# EAGLE design PLA_LED_Gen2_Rev4 (EAGLE 7.7.0)
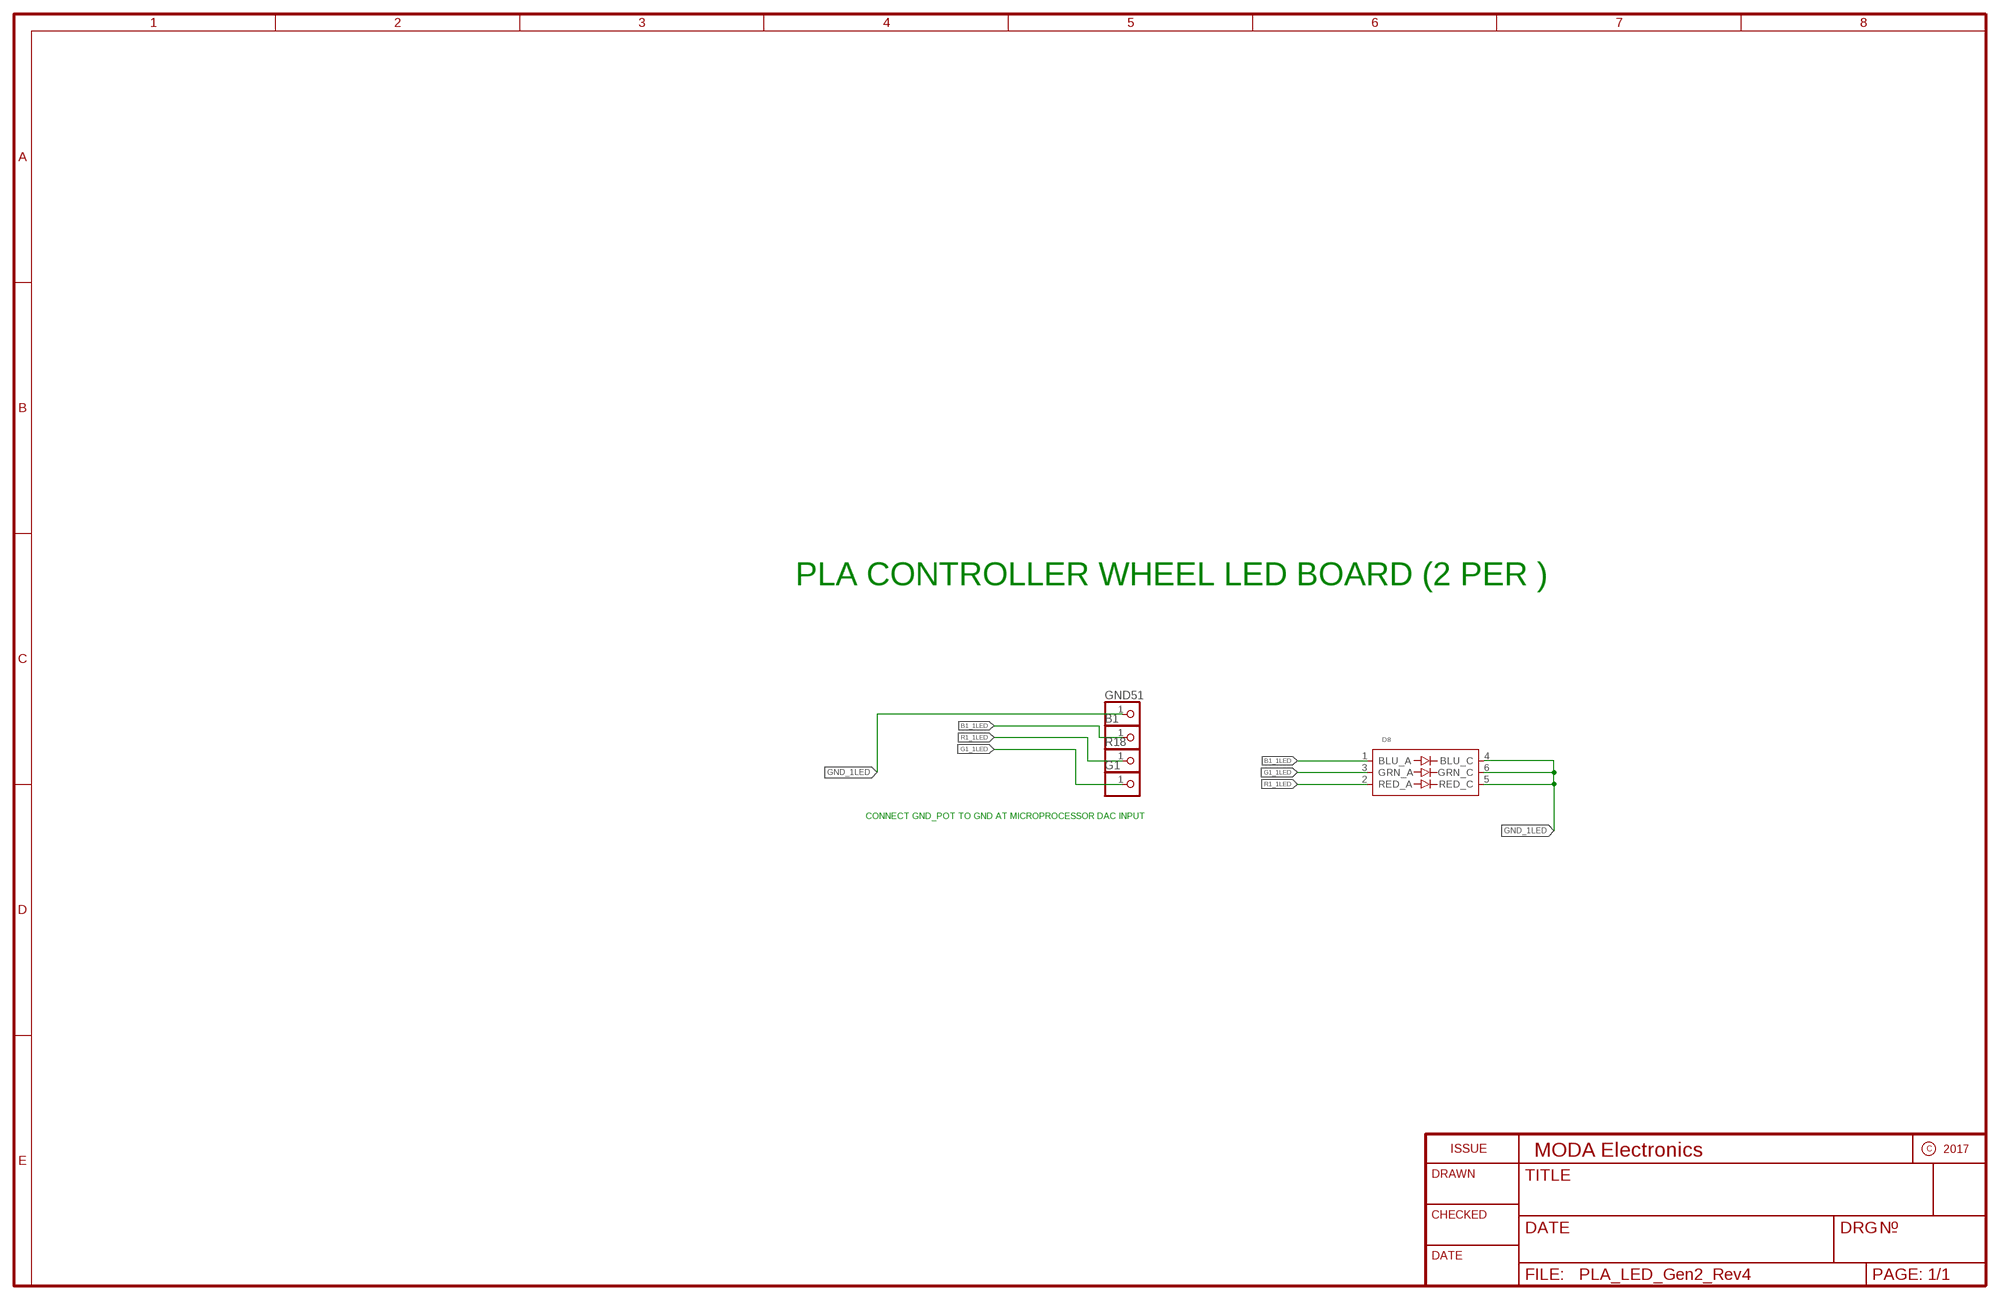
[diagram p0: schematic, sheet 1]

## Parts
B1  PINHD-1X1  [1X01]
D8  XZFBBM2ACRDG92W-3  [XZFBBM2ACRDG92W-3]
G1  PINHD-1X1  [1X01]
GND51  PINHD-1X1  [1X01]
R18  PINHD-1X1  [1X01]

## Nets
B1_1LED: B1.1 D8.1(BLU_A)
G1_1LED: D8.3(GRN_A) G1.1
GND_1LED [vcc]: D8.4(BLU_C) D8.5(RED_C) D8.6(GRN_C) GND51.1
R1_1LED: D8.2(RED_A) R18.1

## Notes on the sheet
- PLA CONTROLLER WHEEL LED BOARD (2 PER )
- CONNECT GND_POT TO GND AT MICROPROCESSOR DAC INPUT

## Library data of the parts
B1 G1 GND51 R18 = adafruit:PINHD-1X1: Pin header 1x1 for 0.1" spacing With round pins; DNP: T; PARTNO: *
D8 = XZFBBM2ACRDG92W-3:XZFBBM2ACRDG92W-3: Red, Green, Blue (RGB) 625nm Red, 525nm Green, 470nm Blue LED Indication - Discrete 2.2V Red, 3.2V Green, 3.3V Blue 6-SMD, No Lead ( https://www.digikey.com/product-detail/en/sunled/XZFBBM2ACRDG92W-3/1497-1226-1-ND/5001279 ); PARTNO: XZFBBM2ACRDG92W-3

## Net classes
0 default: width 0.203 mm, drill 0.305 mm, clearance 0.178 mm
1 vcc: width 0.203 mm, drill 0.305 mm, clearance 0.178 mm
3 diff90: width 0.406 mm, drill 0.356 mm, clearance 0.254 mm

## Board
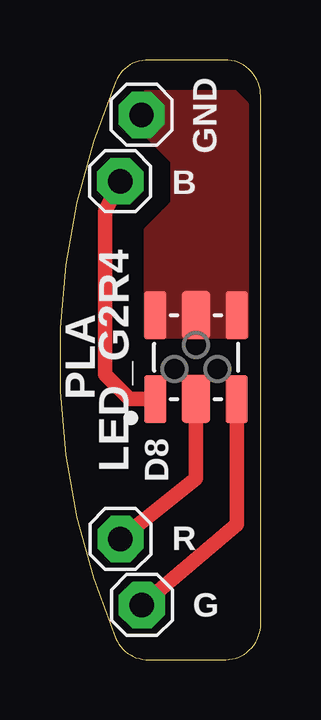
[diagram p1: board, top side]

Size 8.38 x 25 mm. Coordinates in mm from the lower left corner, seen from the top.
Outline: 6.92,0 arc90 8.38,1.51 8.38,23.51 arc90 6.88,25.01 3.71,25.01 arc68 2.32,24.1 arc46 2.32,0.9 arc68 3.72,0 6.92,0
Copper layers (1+2*15+16): Top 0.035mm / dielectric 0.3mm / GND 0.035mm / dielectric 0.85mm / Route15 0.035mm / dielectric 0.3mm / Bottom 0.035mm
Design rules "SSC-EAGLE-4Lyr_v1.0.0.3 *": minimum track width 7mil, minimum drill 12mil, track to track 7mil, track to pad 7mil, pad to pad 7mil, via to via 8mil, smd to smd 0mil, copper to edge 15mil, drill to drill 16mil, minimum pad ring 8mil, minimum via ring 8mil, stop-mask expansion 3mil, vias tented up to drill 14mil, thermal gap 10mil
tRestrict: area -99,-88.1 to -98.3,-88.1

### Footprints (pad centres in the part's own frame; a part is rotated, then mirrored left to right if it is on the bottom)
1X01 = drill 1.016 pad 1.93 octagon: 1 0,0
XZFBBM2ACRDG92W-3 = smd 2 x 0.9: 1 -1.75,1.7; 3 -1.75,-1.7; 4 1.75,1.7; 6 1.75,-1.7 | smd 2 x 1.2: 2 -1.75,0; 5 1.75,0

### Placement (x,y rotation side)
B1  2.52,19.95 0 top
D8  5.68,12.62 90 top
G1  3.42,2.28 0 top
GND51  3.41,22.72 0 top
R18  2.53,5.03 0 top
U$3  [FAB_FRAME_ANSI-A]  -116.72,-111.39 0 top  (outside the outline)
U$4  [FAB_DOCFIELD_GENERIC]  38.05,-111.16 0 top  (outside the outline)

### Tracks (layer width: path | path; a pad name or v marks a point on that pad's centre or on a via)
B1_1LED
  Top 0.61: B1.1 1.88,18.68 1.88,11.9 2.92,10.87 D8.1
G1_1LED
  Top 0.61: D8.3 7.38,5.63 G1.1
GND_1LED
  pour Top (rank 2, no thermals): 7.76,13.49 3.63,13.49 3.63,17.93 4.74,19.04 4.74,20.79 3.15,22.38 3.15,23.17 3.63,23.65 7.28,23.65 7.76,23.17
R1_1LED
  Top 0.61: D8.2 5.68,7.56 R18.1

### Text on the board
tNames: GND | B | LED_G2R4 | PLA | R | G
Document: FILES | Board stackup (mm) / / Layer 1 0.035 foil thickness / Bonding ply 0.3 Dielectric Constant 4.5 (+/- 0.10) / Layer 2 0.035 foil thickness / Laminate Core 0.85 Dielectric Constant 4.5 (+/- 0.10) / Layer 3 0.035 foil thickness / Bonding ply 0.3 Dielectric Constant 4.5 (+/- 0.10) / Layer 4 0.035 foil thickness / / Total Thickness 1.59 | NOTES: | 1. PRINTED CIRCUIT BOARD MADE FROM NEMA GRADE FR-4 EPOXY LAMINATE | WITH 1 OUNCE COPPER PLATING AND .063 THICKNESS. | DRL =DRILL TOOL SIZE INFORMATION (INCHES) / DRD =JOB DRILL DATA (NC DRILL LOCATION INFO) / OLN =OUTLINE / L1 =TOP LAYER (POS LAYER) / SLK=SILKSCREEN TOP / BSK=SILKSCREEN BOT / SMT=SOLDER MASK TOP / SMB=SOLDER MASK BOT / L2 =INNER LAYER 1 / L3 =INNER LAYER 2 / L4 =BOT LAYER / TPS=TOP STENCIL / BPS=BOTTOM STENCIL / MNT=PLACE FILE TOP / MNB=PLACE FILE BOTTOM / BOM= BILL OF MATERIALS / SCHEMATIC / FABDRAWING | 2. ALL DIMENSIONS ARE GIVEN IN INCHES. | 3. CIRCUIT PATHS ARE FOR REFERENCE ONLY. | 4. HOLE SIZES SHOWN ARE FINISHED DIAMETERS AFTER PLATING. | 5. BOARD PLATED USING REFLOW OR SIMILAR METHOD. | 6. APPLY GREEN SOLDER MASK ON PLATED SURFACES USING WET FILM SR100 | OR SR1010 EPOXY. EQUIVALENT WET OR DRY FILM MAY BE USED. | 7. SILKSCREEN TOP and BOTTOM SIDE USING WHITE INK. | 8. THE FOLLOWING INFORMATION APPLIES TO THIS BOARD: | A) 4 COPPER LAYERS | B) 0.063 BOARD THICKNESS | C) REQUIRES TOP AND BOTTOM SILKSCREEN
tDocu: PLA CONTROLLER WHEEL LED BOARD (2 PER)